# EAGLE design AD5764-AD7734_Synchronized (EAGLE 7.2.0)
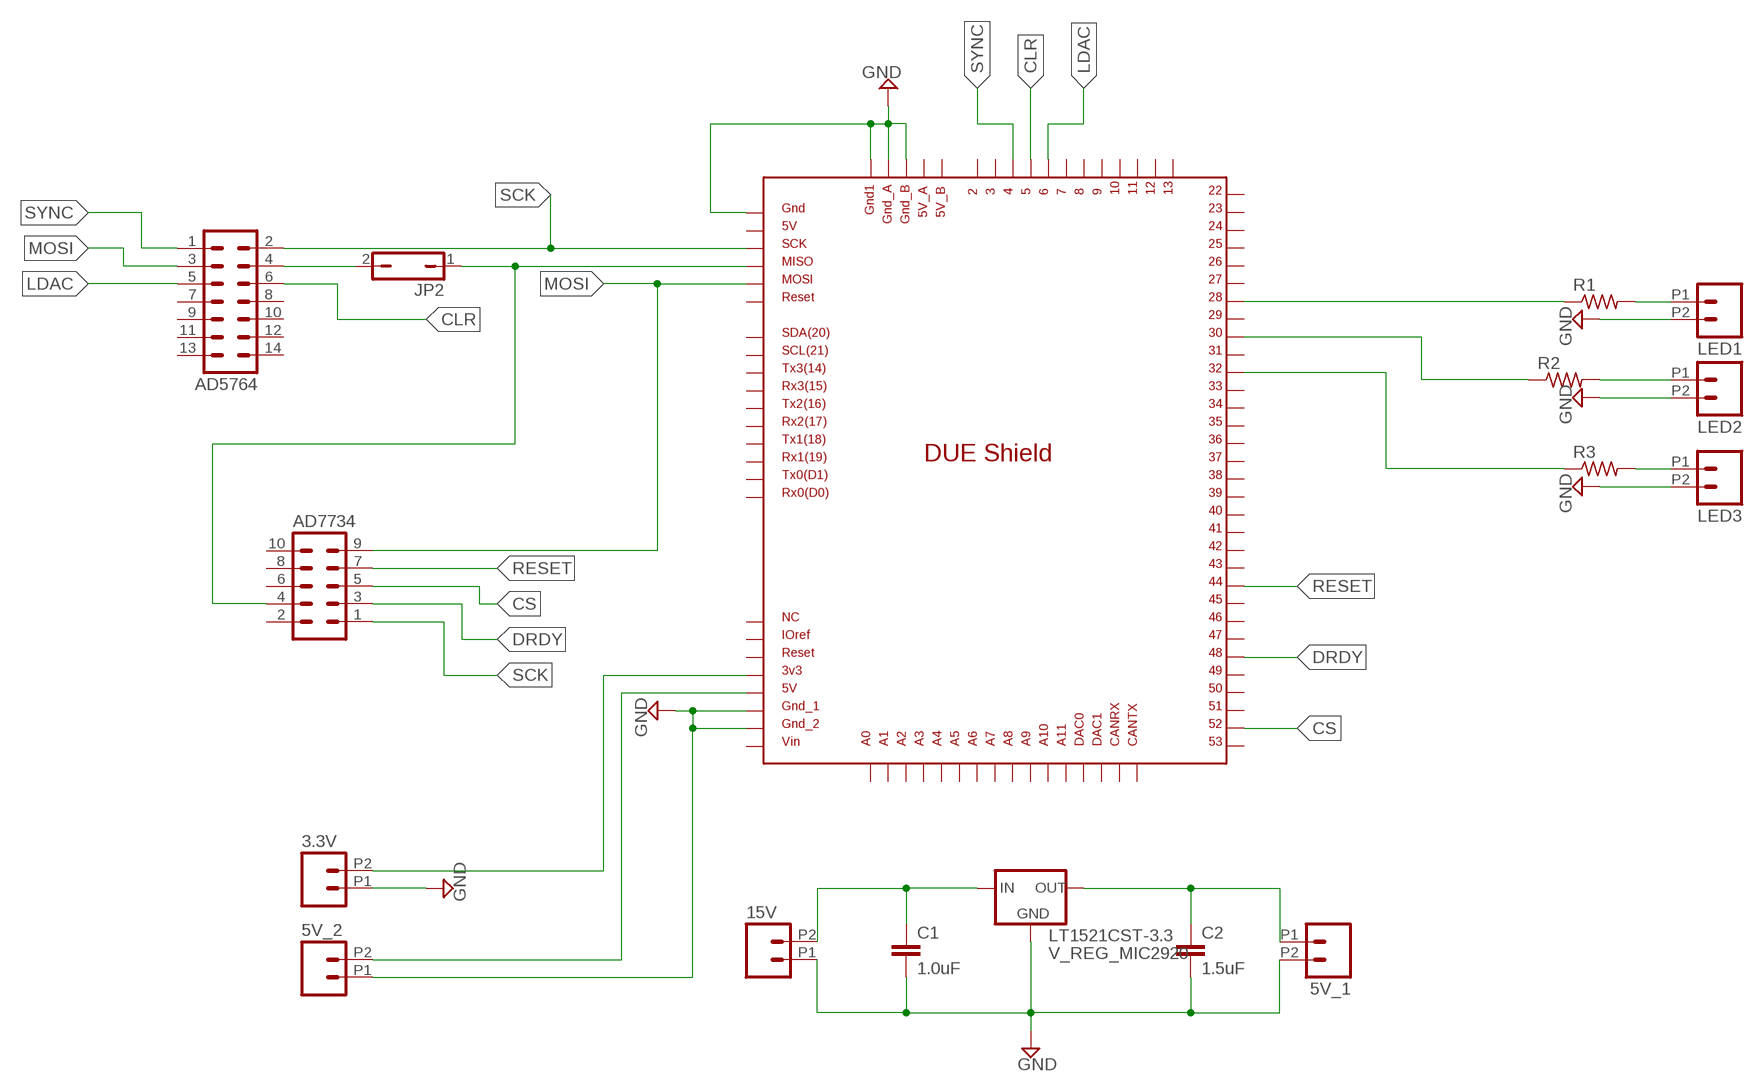
[diagram p0: schematic, sheet 1]

## Parts
3.3V  M022.54MM_SCREWTERM  [1X02_2.54_SCREWTERM]
5V_1  M022.54MM_SCREWTERM  [1X02_2.54_SCREWTERM]
5V_2  M022.54MM_SCREWTERM  [1X02_2.54_SCREWTERM]
15V  M022.54MM_SCREWTERM  [1X02_2.54_SCREWTERM]
AD5764  MA07-2  [MA07-2]
AD7734  MA05-2  [MA05-2]
C1  1.0uF  1.0UF-16V-10%(0603)  [0603-CAP]
C2  1.5uF  1.0UF-16V-10%(0603)  [0603-CAP]
JP2  JP1Q  [JP1]
LED1  M022.54MM_SCREWTERM  [1X02_2.54_SCREWTERM]
LED2  M022.54MM_SCREWTERM  [1X02_2.54_SCREWTERM]
LED3  M022.54MM_SCREWTERM  [1X02_2.54_SCREWTERM]
LT1521CST-3.3  V_REG_MIC2920  [SOT223]
R1  R-US_R1206  [R1206]
R2  R-US_R1206  [R1206]
R3  R-US_R1206  [R1206]
U$2  DUE(REDUCED)  [DUE(REDUCED)]

## Nets
CLR: AD5764.6 U$2.5
CS: AD7734.5 U$2.52
DRDY: AD7734.3 U$2.48
GND: 3.3V.P1 5V_1.P2 5V_2.P1 15V.P1 C1.2 C2.2 LED1.P2 LED2.P2 LED3.P2 LT1521CST-3.3.2(GND) U$2.5V_ICSP U$2.GND1 U$2.GND_1 U$2.GND_2 U$2.GND_A U$2.GND_B
LDAC: AD5764.5 U$2.6
MOSI: AD5764.3 AD7734.9 U$2.MOSI_ICSP
N$1: AD5764.4 JP2.2
N$2: 3.3V.P2 U$2.3V3
N$3: 15V.P2 C1.1 LT1521CST-3.3.1(IN)
N$4: 5V_1.P1 C2.1 LT1521CST-3.3.3(OUT)
N$5: 5V_2.P2 U$2.5V
N$6: R2.1 U$2.30
N$7: R3.1 U$2.32
N$8: R1.1 U$2.28
N$9: LED1.P1 R1.2
N$10: LED2.P1 R2.2
N$11: LED3.P1 R3.2
N$12: AD7734.4 JP2.1 U$2.MISO_ICSP
RESET: AD7734.7 U$2.44
SCK: AD5764.2 AD7734.1 U$2.SCK_ICSP
SYNC: AD5764.1 U$2.4
Unconnected: AD5764.7 AD5764.8 AD5764.9 AD5764.10 AD5764.11 AD5764.12 AD5764.13 AD5764.14 AD7734.2 AD7734.6 AD7734.8 AD7734.10 U$2.2 U$2.3 U$2.5V_A U$2.5V_B U$2.7 U$2.8 U$2.9 U$2.10 U$2.11 U$2.12 U$2.13 U$2.22 U$2.23 U$2.24 U$2.25 U$2.26 U$2.27 U$2.29 U$2.31 U$2.33 U$2.34 U$2.35 U$2.36 U$2.37 U$2.38 U$2.39 U$2.40 U$2.41 U$2.42 U$2.43 U$2.45 U$2.46 U$2.47 U$2.49 U$2.50 U$2.51 U$2.53 U$2.A0 U$2.A1 U$2.A2 U$2.A3 U$2.A4 U$2.A5 U$2.A6 U$2.A7 U$2.A8 U$2.A9 U$2.A10 U$2.A11 U$2.CANRX U$2.CANTX U$2.DAC0 U$2.DAC1 U$2.GND_ICSP U$2.IOREF U$2.NC U$2.RESET U$2.RESET_ICSP U$2.RX0 U$2.RX1 U$2.RX2 U$2.RX3 U$2.SCL U$2.SDA U$2.TX0 U$2.TX1 U$2.TX2 U$2.TX3 U$2.VIN

## Library data of the parts
3.3V 5V_1 5V_2 15V LED1-LED3 = SparkFun-Connectors:M02: Standard 2-pin 0.1" header. Use with - straight break away headers ( PRT-00116) - right angle break away headers (PRT-00553) - swiss pins (PRT-00743) - machine pins (PRT-00117) - female headers (PRT-00115) Molex polarized connector foot print use with: PRT-08233 with associated crimp pins and housings. 2.54_SCREWTERM for use with PRT-10571. 3.5mm Screw Terminal footprints for PRT-08084 5mm Screw Terminal footprints for use with PRT-08432
AD5764 = Arduino_Due_Shield:MA07-2: PIN HEADER; OC_FARNELL: unknown; OC_NEWARK: unknown
AD7734 = Arduino_Due_Shield:MA05-2: PIN HEADER; OC_FARNELL: unknown; OC_NEWARK: unknown
C1 = SparkFun-Capacitors:1.0UF-16V-10%(0603): CAP-00868; PROD_ID: CAP-00868
C2 = SparkFun-Capacitors:1.0UF-16V-10%(0603): CAP-00868; PROD_ID: CAP-00868; VALUE: 1.0uF
JP2 = jumper:JP1Q: JUMPER
LT1521CST-3.3 = SparkFun-PowerIC:V_REG_MIC2920: MIC2920A (http://www.micrel.com/_PDF/mic2920.pdf) - 400mA output LDO Regulator
R1-R3 = resistor:R-US_: RESISTOR, American symbol
U$2 = DUElib130425:DUE(REDUCED)

## Net classes
0 default: width 0.305 mm, drill 0.508 mm, clearance 0.254 mm

## Board
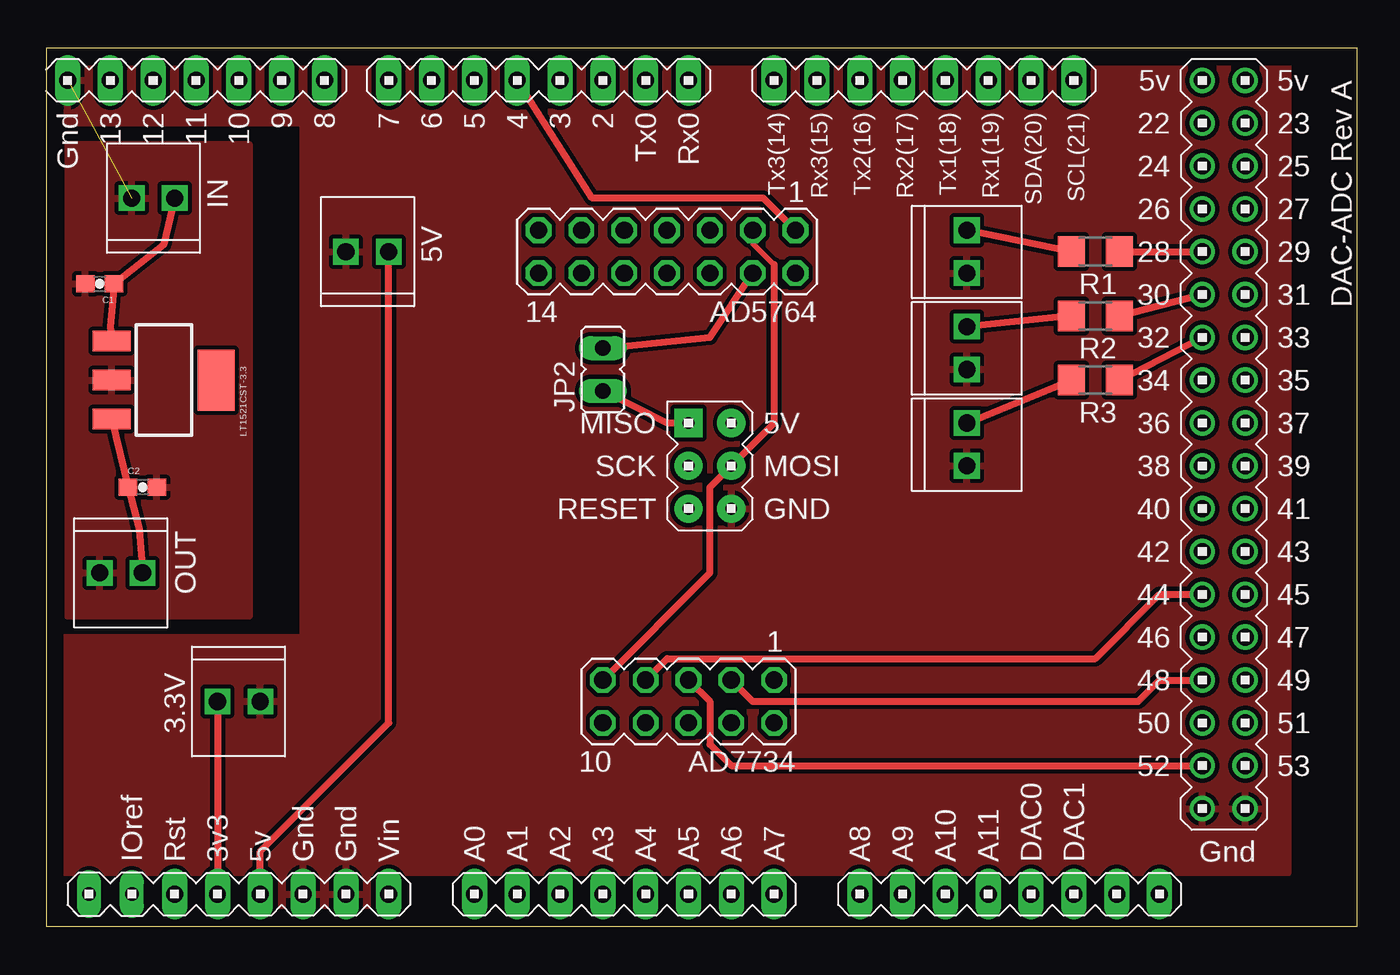
[diagram p1: board, top side]
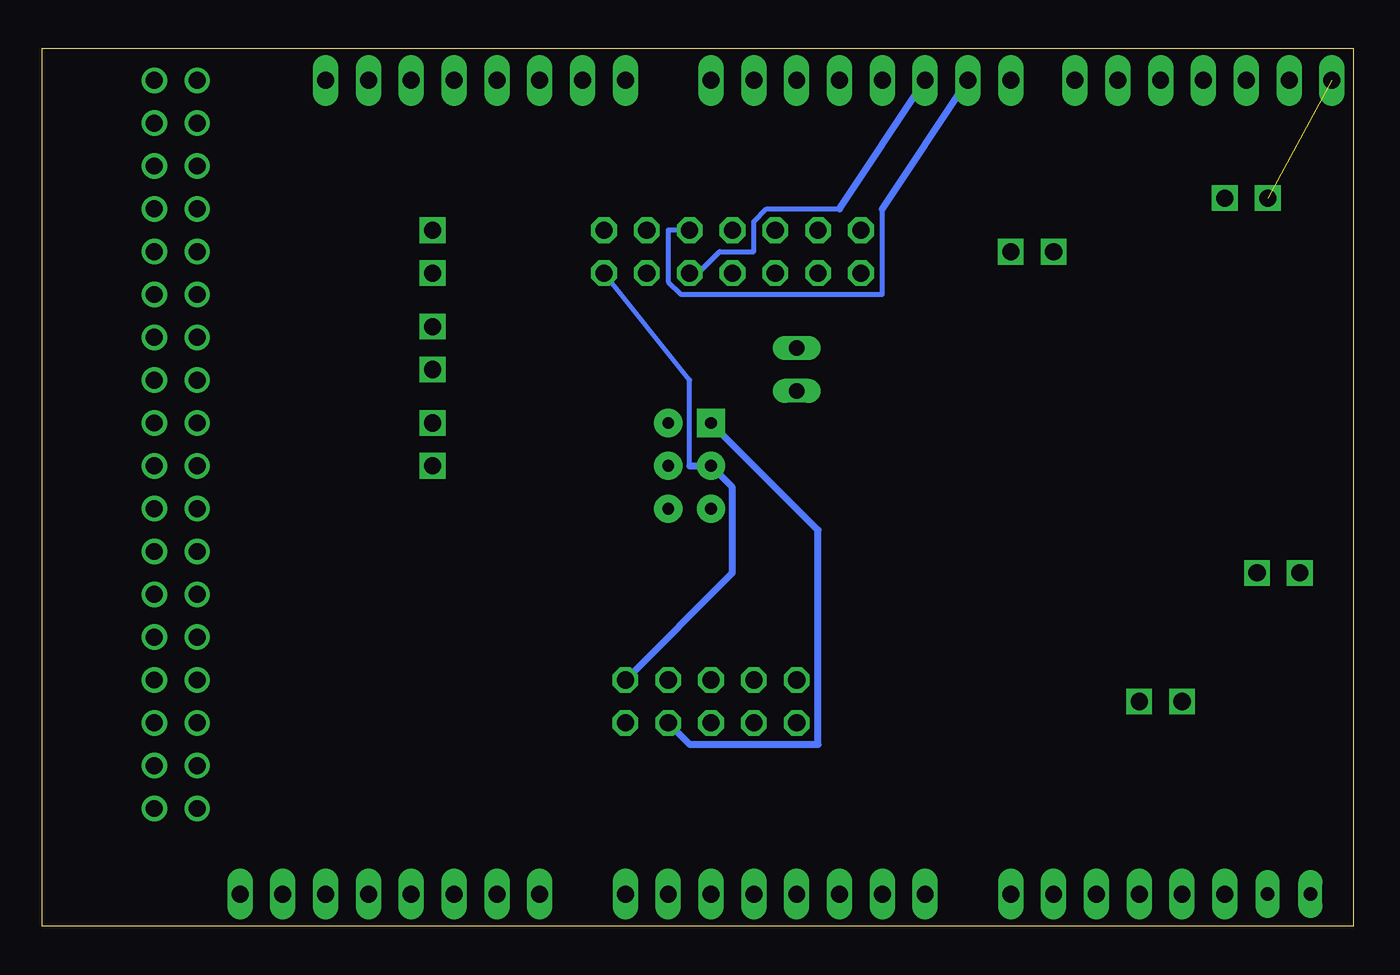
[diagram p2: board, bottom side, seen from below]

Size 77.77 x 52.06 mm. Coordinates in mm from the lower left corner, seen from the top.
Outline: 0,0 77.77,0 77.77,52.06 0,52.06 0,0
Copper layers (1*16): Top 0.035mm / dielectric 1.5mm / Bottom 0.035mm
Design rules "default": minimum track width 10mil, minimum drill 24mil, track to track 8mil, track to pad 8mil, pad to pad 8mil, via to via 8mil, smd to smd 8mil, copper to edge 40mil, drill to drill 8mil, minimum pad ring 10mil, minimum via ring 8mil, stop-mask expansion 4mil, vias tented up to drill 0mil, thermal gap 10mil

### Footprints (pad centres in the part's own frame; a part is rotated, then mirrored left to right if it is on the bottom)
1X02_2.54_SCREWTERM = drill 1.016 square: P1 2.54,0; P2 0,0
MA07-2 = drill 1.016 octagon: 1 -7.62,-1.27; 2 -7.62,1.27; 3 -5.08,-1.27; 4 -5.08,1.27; 5 -2.54,-1.27; 6 -2.54,1.27; 7 0,-1.27; 8 0,1.27; 9 2.54,-1.27; 10 2.54,1.27; 11 5.08,-1.27; 12 5.08,1.27; 13 7.62,-1.27; 14 7.62,1.27
MA05-2 = drill 1.016 octagon: 1 -5.08,-1.27; 2 -5.08,1.27; 3 -2.54,-1.27; 4 -2.54,1.27; 5 0,-1.27; 6 0,1.27; 7 2.54,-1.27; 8 2.54,1.27; 9 5.08,-1.27; 10 5.08,1.27
0603-CAP = smd 1.1 x 1: 1 -0.85,0; 2 0.85,0
JP1 = drill 0.914 long: 1 0,-1.27; 2 0,1.27
SOT223 = smd 1.219 x 2.235: 1 -2.311,-3.099; 2 0,-3.099; 3 2.311,-3.099 | smd 3.6 x 2.2: 4 0,3.099
R1206 = smd 1.6 x 1.803: 1 -1.422,0; 2 1.422,0
DUE(REDUCED) = drill 1 long: 2 3.81,22.86; 3 1.27,22.86; 3V3 -19.05,-25.4; 4 -1.27,22.86; 5 -3.81,22.86; 5V -16.51,-25.4; 6 -6.35,22.86; 7 -8.89,22.86; 8 -12.7,22.86; 9 -15.24,22.86; 10 -17.78,22.86; 11 -20.32,22.86; 12 -22.86,22.86; 13 -25.4,22.86; A0 -3.81,-25.4; A1 -1.27,-25.4; A2 1.27,-25.4; A3 3.81,-25.4; A4 6.35,-25.4; A5 8.89,-25.4; A6 11.43,-25.4; A7 13.97,-25.4; A8 19.05,-25.4; A9 21.59,-25.4; A10 24.13,-25.4; A11 26.67,-25.4; CANRX 34.29,-25.4; CANTX 36.83,-25.4; DAC0 29.21,-25.4; DAC1 31.75,-25.4; GND1 -27.94,22.86; GND_1 -13.97,-25.4; GND_2 -11.43,-25.4; RESET -21.59,-25.4; RX0 8.89,22.86; RX1 26.67,22.86; RX2 21.59,22.86; RX3 16.51,22.86; SCL 31.75,22.86; SDA 29.21,22.86; TX0 6.35,22.86; TX1 24.13,22.86; TX2 19.05,22.86; TX3 13.97,22.86; VIN -8.89,-25.4 | drill 1: 5V_A 39.37,22.86; 5V_B 41.91,22.86; 22 39.37,20.32; 23 41.91,20.32; 24 39.37,17.78; 25 41.91,17.78; 26 39.37,15.24; 27 41.91,15.24; 28 39.37,12.7; 29 41.91,12.7; 30 39.37,10.16; 31 41.91,10.16; 32 39.37,7.62; 33 41.91,7.62; 34 39.37,5.08; 35 41.91,5.08; 36 39.37,2.54; 37 41.91,2.54; 38 39.37,0; 39 41.91,0; 40 39.37,-2.54; 41 41.91,-2.54; 42 39.37,-5.08; 43 41.91,-5.08; 44 39.37,-7.62; 45 41.91,-7.62; 46 39.37,-10.16; 47 41.91,-10.16; 48 39.37,-12.7; 49 41.91,-12.7; 50 39.37,-15.24; 51 41.91,-15.24; 52 39.37,-17.78; 53 41.91,-17.78; GND_A 39.37,-20.32; GND_B 41.91,-20.32 | drill 0.7 pad 1.676: 5V_ICSP 11.43,-2.54; GND_ICSP 11.43,2.54; MOSI_ICSP 11.43,0; RESET_ICSP 8.89,-2.54; SCK_ICSP 8.89,0 | drill 0.8 pad 1.422 long: IOREF -24.13,-25.4; NC -26.67,-25.4 | drill 0.7 pad 1.676 square: MISO_ICSP 8.89,2.54

### Placement (x,y rotation side)
3.3V  10.16,13.33 0 top
5V_1  3.17,20.96 0 top
5V_2  20.32,40.01 180 top
15V  7.62,43.18 180 top
AD5764  36.83,40.01 180 top
AD7734  38.1,13.33 180 top
C1  3.17,38.1 180 top
C2  5.71,26.04 0 top
JP2  33.02,33.02 0 top
LED1  54.61,38.73 90 top
LED2  54.61,33.02 90 top
LED3  54.61,27.3 90 top
LT1521CST-3.3  6.98,32.39 270 top
R1  62.23,40.01 180 top
R2  62.23,36.2 180 top
R3  62.23,32.39 180 top
U$2  29.21,27.3 0 top

### Tracks (layer width: path | path; a pad name or v marks a point on that pad's centre or on a via)
CLR
  Bottom 0.305: 30.48,42.55 34.8,42.55 35.56,41.78 35.56,40.01 37.59,40.01 38.86,38.73 AD5764.6
  Bottom 0.406: 30.48,42.55 U$2.5
CS
  Top 0.406: AD7734.5 39.37,13.33 39.37,10.79 40.64,9.53 U$2.52
DRDY
  Top 0.406: AD7734.3 41.91,13.33 64.77,13.33 66.04,14.61 U$2.48
GND  (1 unrouted)
  pour Top: 0,52.07 73.66,52.07 73.66,3.18 19.05,3.18 19.05,0.63 13.97,0.63 13.97,3.18 0,3.18 0,17.15 15.24,17.15 15.24,47.62 0,47.62
  pour Top: 1.27,18.41 12.06,18.41 12.06,46.36 1.27,46.36
LDAC
  Bottom 0.305: 27.94,42.55 27.94,37.47 39.88,37.47 40.64,38.23 40.64,41.28 AD5764.5
  Bottom 0.406: 27.94,42.55 U$2.6
MOSI
  Top 0.305: AD5764.3 41.91,40.51 43.18,39.24
  Top 0.406: 43.18,39.24 43.18,29.84 U$2.MOSI_ICSP 39.37,26.04 39.37,20.96 AD7734.9
N$1
  Top 0.406: JP2.2 39.37,34.93 AD5764.4
N$2
  Top 0.406: 3.3V.P2 U$2.3V3
N$3
  Top 0.406: 15V.P2 6.98,40.43 C1.1 3.81,35.56 LT1521CST-3.3.1
N$4
  Top 0.406: LT1521CST-3.3.3 C2.1 5.52,23.55 5V_1.P1
N$5
  Top 0.406: U$2.5V 12.7,4.45 20.32,12.06 5V_2.P2
N$6
  Top 0.406: R2.1 U$2.30
N$7
  Top 0.406: R3.1 U$2.32
N$8
  Top 0.406: R1.1 U$2.28
N$9
  Top 0.406: R1.2 LED1.P1
N$10
  Top 0.406: R2.2 LED2.P1
N$11
  Top 0.406: R3.2 LED3.P1
N$12
  Top 0.406: U$2.MISO_ICSP 36.83,29.84 JP2.1
  Bottom 0.406: AD7734.4 39.37,10.79 31.75,10.79 31.75,23.5 U$2.MISO_ICSP
RESET
  Top 0.406: AD7734.7 36.83,15.88 62.23,15.88 66.04,19.69 U$2.44
SCK
  Bottom 0.305: AD5764.2 39.37,32.39 39.37,27.3
  Bottom 0.406: 39.37,27.3 U$2.SCK_ICSP 36.83,26.04 36.83,20.96 AD7734.1
SYNC
  Top 0.406: AD5764.1 42.55,43.18 32.39,43.18 U$2.4

### Text on the board
tPlace: DAC-ADC Rev A | IN | 5V | OUT | 3.3V